# Altium schematic sheet AC  circuit.SchDoc
size A4; SheetNumber: 6; SheetTotal: 8
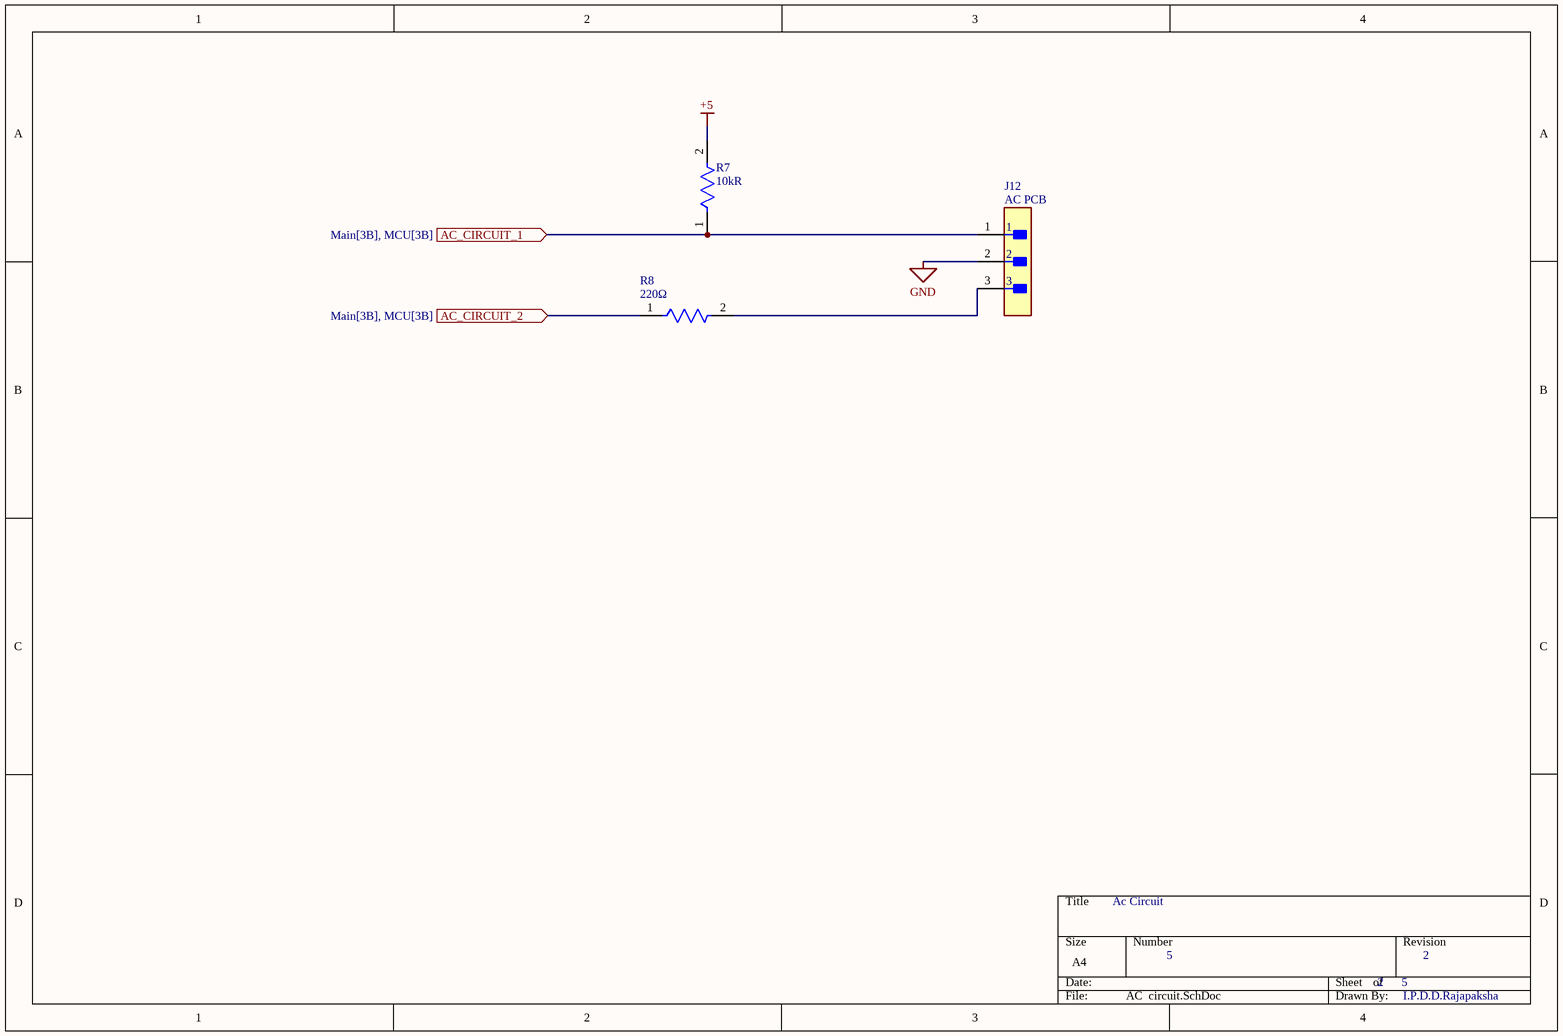
[diagram p0: AC  circuit.SchDoc]

## Parts
J12  Parameter 1: AC PCB  [FP-B3B-XH-A_LF_SN-MFG]  (hidden comment: B3B-XH-A(LF)(SN))
R7  Resistance: 10kR  [FP-CRCW1206-e3-IPC_C]  (hidden comment: CRCW120610K0FKEA)
R8  value 220Ω  [FP-AC1206-MFG]  (hidden comment: AC1206FR-07220RL)

## Ports
AC_CIRCUIT_1 (in, see Main[3B], MCU[3B]), AC_CIRCUIT_2 (in, see Main[3B], MCU[3B])

## Nets
+5: R7.2
GND: J12.2
AC_CIRCUIT_1: J12.1 R7.1 ; port AC_CIRCUIT_1
AC_CIRCUIT_2: R8.1 ; port AC_CIRCUIT_2
NetJ12_3: J12.3 R8.2

## Notes on the sheet
- Ac Circuit
- 5
- 2      5
- 2
- I.P.D.D.Rajapaksha

## Library data of the parts
J12 = CMP-17439-000014-3: CONN HEADER VERT 3POS 2.5MM; Max Voltage Rating (DC): 250V; Number of Positions: 3; Current Rating: 3A; Gender: Male; Wire/Cable Gauge: 22AWG; Contact Resistance: 20mR; Insulation Resistance: 1GR; AC PCB: POT; Insulation Material: Nylon; Contact Plating: Tin; Depth: 5.75mm; Contact Type: Male Pin; Max Operating Temperature: 85°C; Insulation Color: Natural; Voltage Rating (AC): 250V; Color: Natural; Connector Type: Header; Orientation: Straight; Fastening Type: Detent; Housing Color: White; Min Operating Temperature: -25°C; Termination: Solder; Voltage Rating: 250V; Series: XH; Pitch: 2.5mm; Contact Shape: Square; Number of Rows: 1; Lead Free: Lead Free; Packaging: Bulk; Mount: Through Hole; Flammability Rating: UL94 V-0; Max Voltage Rating (AC): 250V; REACH SVHC: No SVHC; Housing Material: Polyamide; Contact Material: Brass; Lead Pitch: 2.5mm; Contact Finish - Mating: TIN; Length: 9.9mm; Max Current Rating: 3A; Number of Contacts: 3
R7 = CMP-2003-04807-2: RES Thick Film, 10kΩ, 1%, 0.25W, 100ppm/°C, 1206; Working Voltage: 200V; Max Power Dissipation: 250mW; Tolerance: 1%; Width: 0.063inch; Height: 0.55mm; Number of Pins: 2; Voltage Rating: 200V; Temperature Coefficient: 100ppm/°C; Military Standard: Not; Features: Automotive AEC-Q200; Depth: 1.6mm; Radiation Hardening: No; Termination: SMD/SMT; Case Code (Imperial): 1206; Weight: 0.000353oz; Length: 3.2mm; Package Quantity: 10; Voltage Rating (DC): 200V; Case/Package: 1206; Min Operating Temperature: -55°C; Number of Terminations: 2; Composition: Thick Film; Contact Plating: Tin; Power Rating: 250mW; Packaging: Tape and Reel; Max Operating Temperature: 155°C; Lead Free: Lead Free; Case Code (Metric): 3216
R8 = CMP-03412-034136-1: RES SMD 220 OHM 1% 1/4W 1206; Manufacturer: Yageo; Power Rating: 0.25W; Tolerance: 0.01; Automotive Grade: Grade 0; Voltage Rating: 200V; Package: AC1206; Series: AC; Device Class L1: Passive Components; Manufacturer Part Number: AC1206FR-07220RL; Ipc Land Pattern Name: RESC310160X55; Temperature Range Low: -55°C; Temperature Range High: +155°C; Category: Res; Digikey Description: RES SMD 220 OHM 1% 1/4W 1206; ComponentLink2URL: http://www.yageo.com/NewPortal/yageodocoutput?fileName=/pdf/R-Chip/PYu-AC_51_RoHS_L_6.pdf; Device Class L2: Resistors; Mouser Description: Thick Film Resistors - SMD 1/4W 220ohm 1% AEC-Q200; Octopart: https://octopart.com/ac1206fr-07220rl-yageo-30511077; Composition: Thick Film; Height: 0.65mm; Automotive: Yes; Device Class L3: Chip SMD Resistors; Lead Free: Yes; Temperature: -55°C to +155°C; RoHS: TRUE; Resistance: 220Ω; ComponentLink2Description: Datasheet; Footprint Url: http://www.yageo.com/exep/pages/download/literatures/PYu-R_Mount_10.pdf